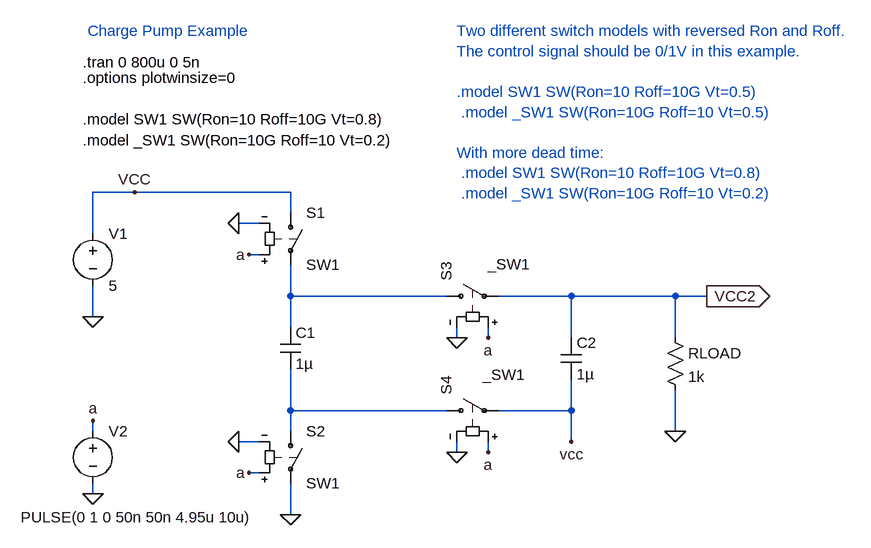
[diagram p0: schematic change-over-switch.asc]
change-over-switch.asc, the LTspice schematic file:
Version 4
SHEET 1 1176 680
WIRE -48 80 -112 80
WIRE 192 80 -48 80
WIRE 192 112 192 80
WIRE 144 128 112 128
WIRE -112 144 -112 80
WIRE 144 176 128 176
WIRE 192 240 192 192
WIRE 432 240 192 240
WIRE 624 240 512 240
WIRE 784 240 624 240
WIRE 832 240 784 240
WIRE -112 272 -112 224
WIRE 192 288 192 240
WIRE 448 304 448 288
WIRE 496 304 496 288
WIRE 624 304 624 240
WIRE 784 304 784 240
WIRE 192 416 192 352
WIRE 432 416 192 416
WIRE 624 416 624 368
WIRE 624 416 512 416
WIRE -112 448 -112 432
WIRE 192 448 192 416
WIRE 784 448 784 384
WIRE 144 464 112 464
WIRE 624 464 624 416
WIRE 448 480 448 464
WIRE 496 480 496 464
WIRE 144 512 128 512
WIRE -112 544 -112 528
WIRE 192 576 192 528
FLAG 112 128 0
FLAG 112 464 0
FLAG 192 576 0
FLAG -112 272 0
FLAG 448 304 0
FLAG 448 480 0
FLAG 496 304 a
FLAG 496 480 a
FLAG 128 176 a
FLAG 128 512 a
FLAG -112 544 0
FLAG -112 432 a
FLAG -48 80 VCC
FLAG 624 464 vcc
FLAG 784 448 0
FLAG 832 240 VCC2
IOPIN 832 240 Out
SYMBOL sw 192 96 R0
SYMATTR InstName S1
SYMATTR Value SW1
SYMBOL sw 192 432 R0
SYMATTR InstName S2
SYMATTR Value SW1
SYMBOL cap 176 288 R0
SYMATTR InstName C1
SYMATTR Value 1µ
SYMBOL cap 608 304 R0
SYMATTR InstName C2
SYMATTR Value 1µ
SYMBOL sw 416 240 R270
WINDOW 3 49 79 VRight 0
SYMATTR InstName S3
SYMATTR Value _SW1
SYMBOL sw 416 416 R270
WINDOW 3 55 72 VRight 0
SYMATTR InstName S4
SYMATTR Value _SW1
SYMBOL voltage -112 128 R0
SYMATTR InstName V1
SYMATTR Value 5
SYMBOL voltage -112 432 R0
WINDOW 3 -111 148 Left 0
WINDOW 123 0 0 Left 0
WINDOW 39 0 0 Left 0
SYMATTR InstName V2
SYMATTR Value PULSE(0 1 0 50n 50n 4.95u 10u)
SYMBOL res 768 288 R0
SYMATTR InstName RLOAD
SYMATTR Value 1k
TEXT -128 0 Left 0 !.model _SW1 SW(Ron=10G Roff=10 Vt=0.2)
TEXT -128 -32 Left 0 !.model SW1 SW(Ron=10 Roff=10G Vt=0.8)
TEXT -128 -120 Left 0 !.tran 0 800u 0 5n
TEXT -128 -96 Left 0 !.options plotwinsize=0
TEXT -120 -168 Left 0 ;Charge Pump Example
TEXT 448 -168 Left 0 ;Two different switch models with reversed Ron and Roff.\nThe control signal should be 0/1V in this example.\n \n.model SW1 SW(Ron=10 Roff=10G Vt=0.5)\n .model _SW1 SW(Ron=10G Roff=10 Vt=0.5)\n \nWith more dead time:\n .model SW1 SW(Ron=10 Roff=10G Vt=0.8)\n .model _SW1 SW(Ron=10G Roff=10 Vt=0.2)

The netlist it stands for:
* change-over-switch.asc
S1 VCC N001 a 0 SW1
S2 N002 0 a 0 SW1
C1 N001 N002 1µ
C2 VCC2 VCC 1µ
S3 N001 VCC2 a 0 _SW1
S4 N002 VCC a 0 _SW1
V1 VCC 0 5
V2 a 0 PULSE(0 1 0 50n 50n 4.95u 10u)
RLOAD VCC2 0 1k
.model _SW1 SW(Ron=10G Roff=10 Vt=0.2)
.model SW1 SW(Ron=10 Roff=10G Vt=0.8)
.tran 0 800u 0 5n
.options plotwinsize=0
* Charge Pump Example
* Two different switch models with reversed Ron and Roff.
* The control signal should be 0/1V in this example.
* .model SW1 SW(Ron=10 Roff=10G Vt=0.5)
*  .model _SW1 SW(Ron=10G Roff=10 Vt=0.5)
* With more dead time:
*  .model SW1 SW(Ron=10 Roff=10G Vt=0.8)
*  .model _SW1 SW(Ron=10G Roff=10 Vt=0.2)
.backanno
.end